# EAGLE schematic Voltage_Feedback v2 (EAGLE 9.7.0)
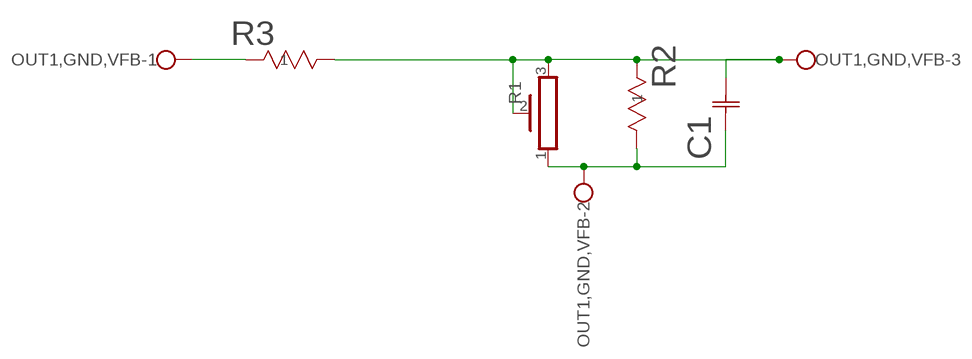
[diagram p0: schematic, sheet 1]

## Parts
C1  564R60GAD10CAP_60GAD10_VIS  [CAP_60GAD10_VIS]
OUT1,GND,VFB  W237-03P  [W237-133]
R1  PV36P  [PV36P]
R2  CF14JT10K0STA_CF14_STP  [STA_CF14_STP]
R3  CF14JT10K0STA_CF14_STP  [STA_CF14_STP]

## Nets
N$1: OUT1,GND,VFB.1 R3.1
N$2: C1.2 OUT1,GND,VFB.3 R1.2 R1.3 R2.1 R3.2
N$3: C1.1 OUT1,GND,VFB.2 R1.1 R2.2

## Library data of the parts
C1 = 2024-12-05_10-34-19_Library:564R60GAD10; COPYRIGHT: Copyright (C) 2024 Ultra Librarian. All rights reserved.; MANUFACTURER_PART_NUMBER: 564R60GAD10; MFR_NAME: Vishay
OUT1,GND,VFB = con-wago-508:W237-03P: WAGO SREW CLAMP
R1 = Resistor:PV36: Rectangular Trimmer Potentiometers - PV36 Series Datasheet <https://www.bourns.com/docs/Product-Datasheets/pv36.pdf>; CATEGORY: Resistor; DESCRIPTION: Lead Sealed Type Multiturn PV36 Series; MANUFACTURER: BOURNS; MPN: PV36P; OPERATING_TEMPERATURE: -55 to +125 °C; PART_STATUS: Active; ROHS_COMPLIANCE: RoHS Compliant; SERIES: PV36; SUB-CATEGORY: Trimpot; TYPE: Lead Sealed
R2 R3 = 2024-12-04_14-13-54_Library:CF14JT10K0; COPYRIGHT: Copyright (C) 2024 Ultra Librarian. All rights reserved.; MANUFACTURER_PART_NUMBER: CF14JT10K0; MFR_NAME: Stackpole International